# EAGLE design DQ542MA GRBL (EAGLE 8.4.3)
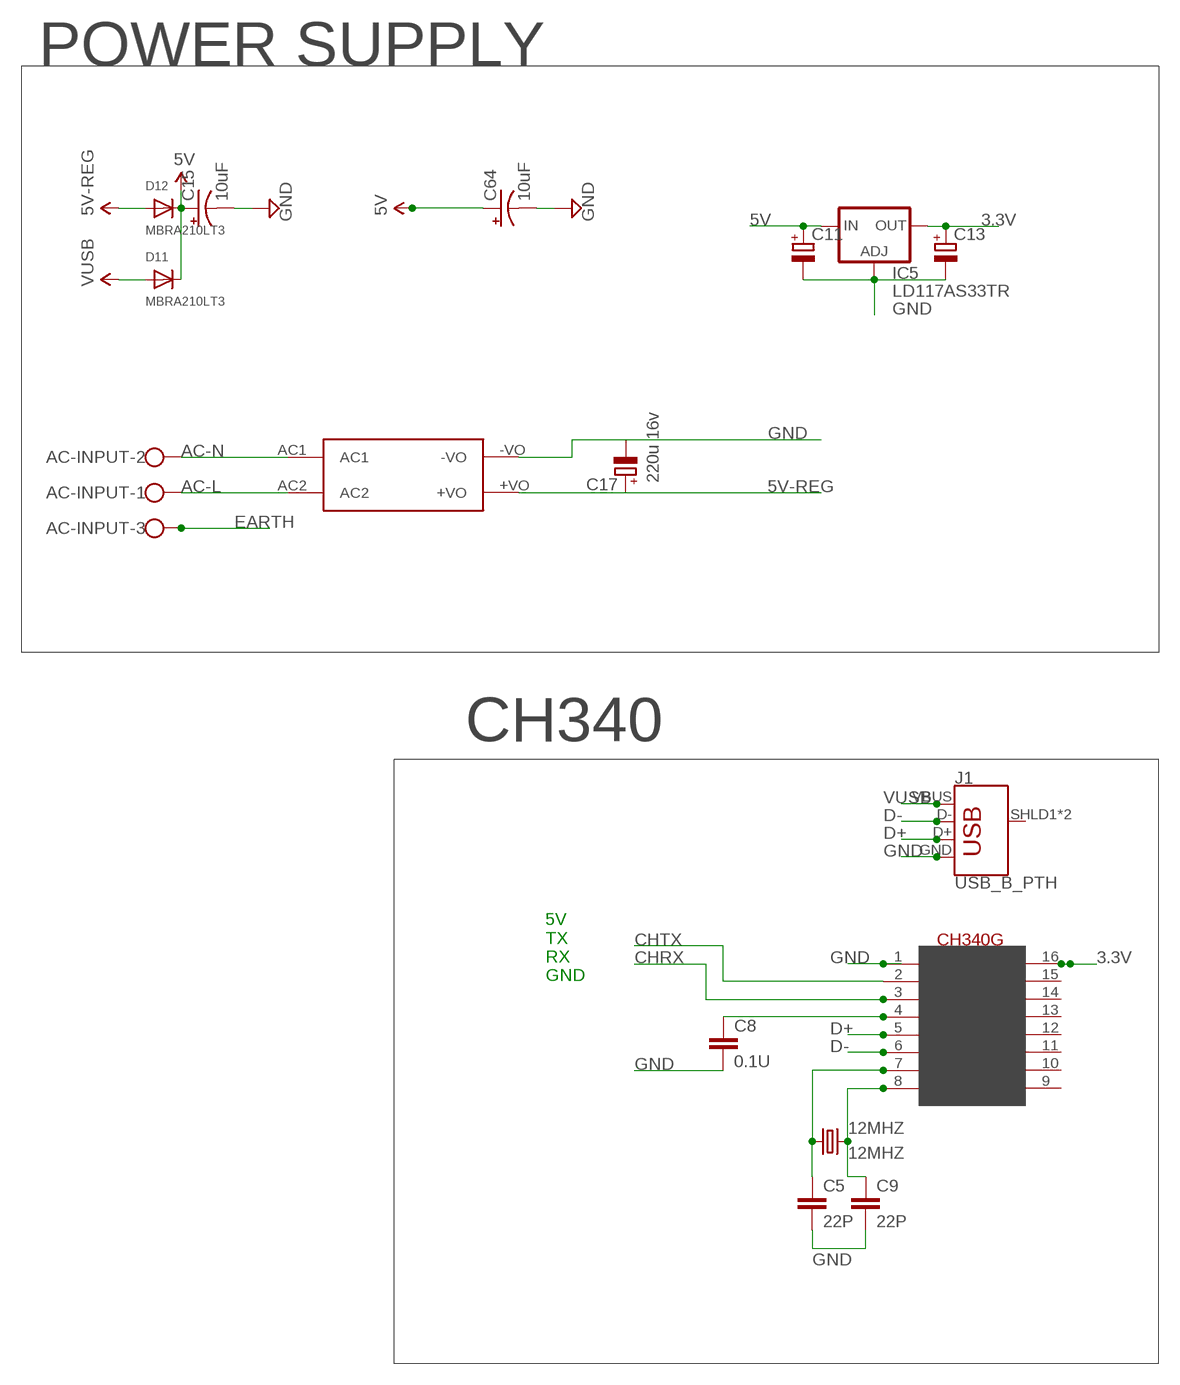
[diagram p0: schematic, sheet 1]

## Parts
12MHZ  12MHZ  CRYSTALHC49U70  [HC49U70]
AC-INPUT  W237-103  [W237-103]
C5  22P  C-EUC1206  [C1206]
C8  0.1U  C-EUC1206  [C1206]
C9  22P  C-EUC1206  [C1206]
C11  CPOL-EUC  [PANASONIC_C]
C13  CPOL-EUC  [PANASONIC_C]
C15  10uF  CAP_POL1206  [EIA3216]
C17  220u 16v  CPOL-EUE  [PANASONIC_E]
C64  10uF  CAP_POL1206  [EIA3216]
D11  MBRA210LT3  DIODESMA  [SMADIODE]
D12  MBRA210LT3  DIODESMA  [SMADIODE]
IC5  LD117AS33TR  [SOT223]
J1  USB_B_PTH  [USB-B-PTH]
U$2  CH340G  [SOIC16]
U$4  HLK-PM01  [HLK-PM01]

## Nets
3.3V: C8.1 C13.+ IC5.4(OUT) U$2.4(V3) U$2.16(VCC)
5V: C11.+ C15.A(+) C64.A(+) D11.C D12.C IC5.3(IN)
5V-REG: C17.+ D12.A U$4.+VO
AC-L: AC-INPUT.1 U$4.AC2
AC-N: AC-INPUT.2 U$4.AC1
CHRX: U$2.3(RX)
CHTX: U$2.2(TX)
D+: J1.D+ U$2.5(D+)
D-: J1.D- U$2.6(D-)
EARTH: AC-INPUT.3
GND: C5.2 C8.2 C9.2 C11.- C13.- C15.C(-) C17.- C64.C(-) IC5.1(ADJ) J1.GND U$2.1(GND) U$4.-VO
N$9: 12MHZ.1 C5.1 U$2.7(XI)
N$11: 12MHZ.2 C9.1 U$2.8(XO)
VUSB: D11.A J1.VBUS
Unconnected: J1.SHLD1(SHIELD) J1.SHLD2(SHIELD) U$2.9(CTS) U$2.10(DSR) U$2.11(RI) U$2.12(DCD) U$2.13(DTR) U$2.14(RTS) U$2.15(RS232)

## Notes on the sheet
- POWER SUPPLY
- CH340
- 5V
  TX
  RX
  GND

## Library data of the parts
12MHZ = crystal:CRYSTAL: CRYSTAL; OC_FARNELL: unknown; OC_NEWARK: unknown
AC-INPUT = con-wago-500:W237-103: WAGO SCREW CLAMP; MPN: 237-103; OC_FARNELL: unknown; OC_NEWARK: 18M7116
C5 C8 C9 = rcl:C-EU: CAPACITOR, European symbol
C11 C13 C17 = rcl:CPOL-EU: POLARIZED CAPACITOR, European symbol
C15 C64 = SparkFun:CAP_POL: Capacitor Polarized These are standard SMD and PTH capacitors. Normally 10uF, 47uF, and 100uF in electrolytic and tantalum varieties. Always verify the external diameter of the through hole cap, it varies with capacity, voltage, and manufacturer. The EIA devices should be standard.
D11 D12 = microbuilder:DIODE: Diode SMADIODE - SMA Surface Mount Package 20V 1A Schottky Diode Digikey (500mV @ 1A, 500uA Vr @ 20V): 641-1014-6-ND 10V 2A Schottky Diode Digikey (350mV @ 2A, 700uA Vr @ 10V): MBRA210LT3 SOD-123 30V 200mA (800mV Vf, 2uA Vr @ 25V) Schottky Diode (very fast switching for boost, etc.) - Digikey: BAT54T1GOSTR-ND 30V 500mA (430mV Vf, 130uA Vr @ 30V) Schottky Diode - Digikey: B0530W-FDICT-ND MBR120 1A 20V (0.34Vf) Schottky Diode - Digikey: MBR120VLSFT1GOSCT-ND SOD-323 10V 570mA (380mV Vf, 3ns) Schottky Diode - Digikey: ZLLS410CT-ND 1N4148WS - 75V 150mA (1V Vf @ 10mA, 4ns) Simple Diode - Digikey: 1N4148WSFSCT-ND, Mouser: 512-1N4148WS SOD-523 BAT54 30V 200mA Schottky (0.8 Vf @ 100mA, 5ns) - Digikey: BAT54XV2CT-ND 30V 30mA Schottky Diode (RB751S-40TE61) - Digikey: RB751S-40TE61CT-ND SOT23-R/W - SOT23 Package (R = Solder Paste/Reflow Ovens, W = Hand-Soldering) BAT54Film 40V 300mA - Digikey: 497-7162-1-ND DO-1N4148 Through Hole Small Current Diode (any model)
IC5 = v-reg:LD117A?*: Low drop fixed and adjustable positive voltage regulators 1 A Source: http://www.st.com/stonline/products/literature/ds/7194/ld1117axx.pdf
J1 = SparkFun-Connectors:USB_B: USB Type B Connector SparkFun Products: SparkFun Stepoko <https://www.sparkfun.com/products/13899> PTH; PROD_ID: CONN-08278; SF_ID: PRT-00139
U$2 = usb-serial:CH340G
U$4 = hlk-pm01:HLK-PM01

## Net classes
1 power: width 0.6 mm, clearance 0.305 mm
5 3.3-Amp Class: width 1.27 mm

## Board
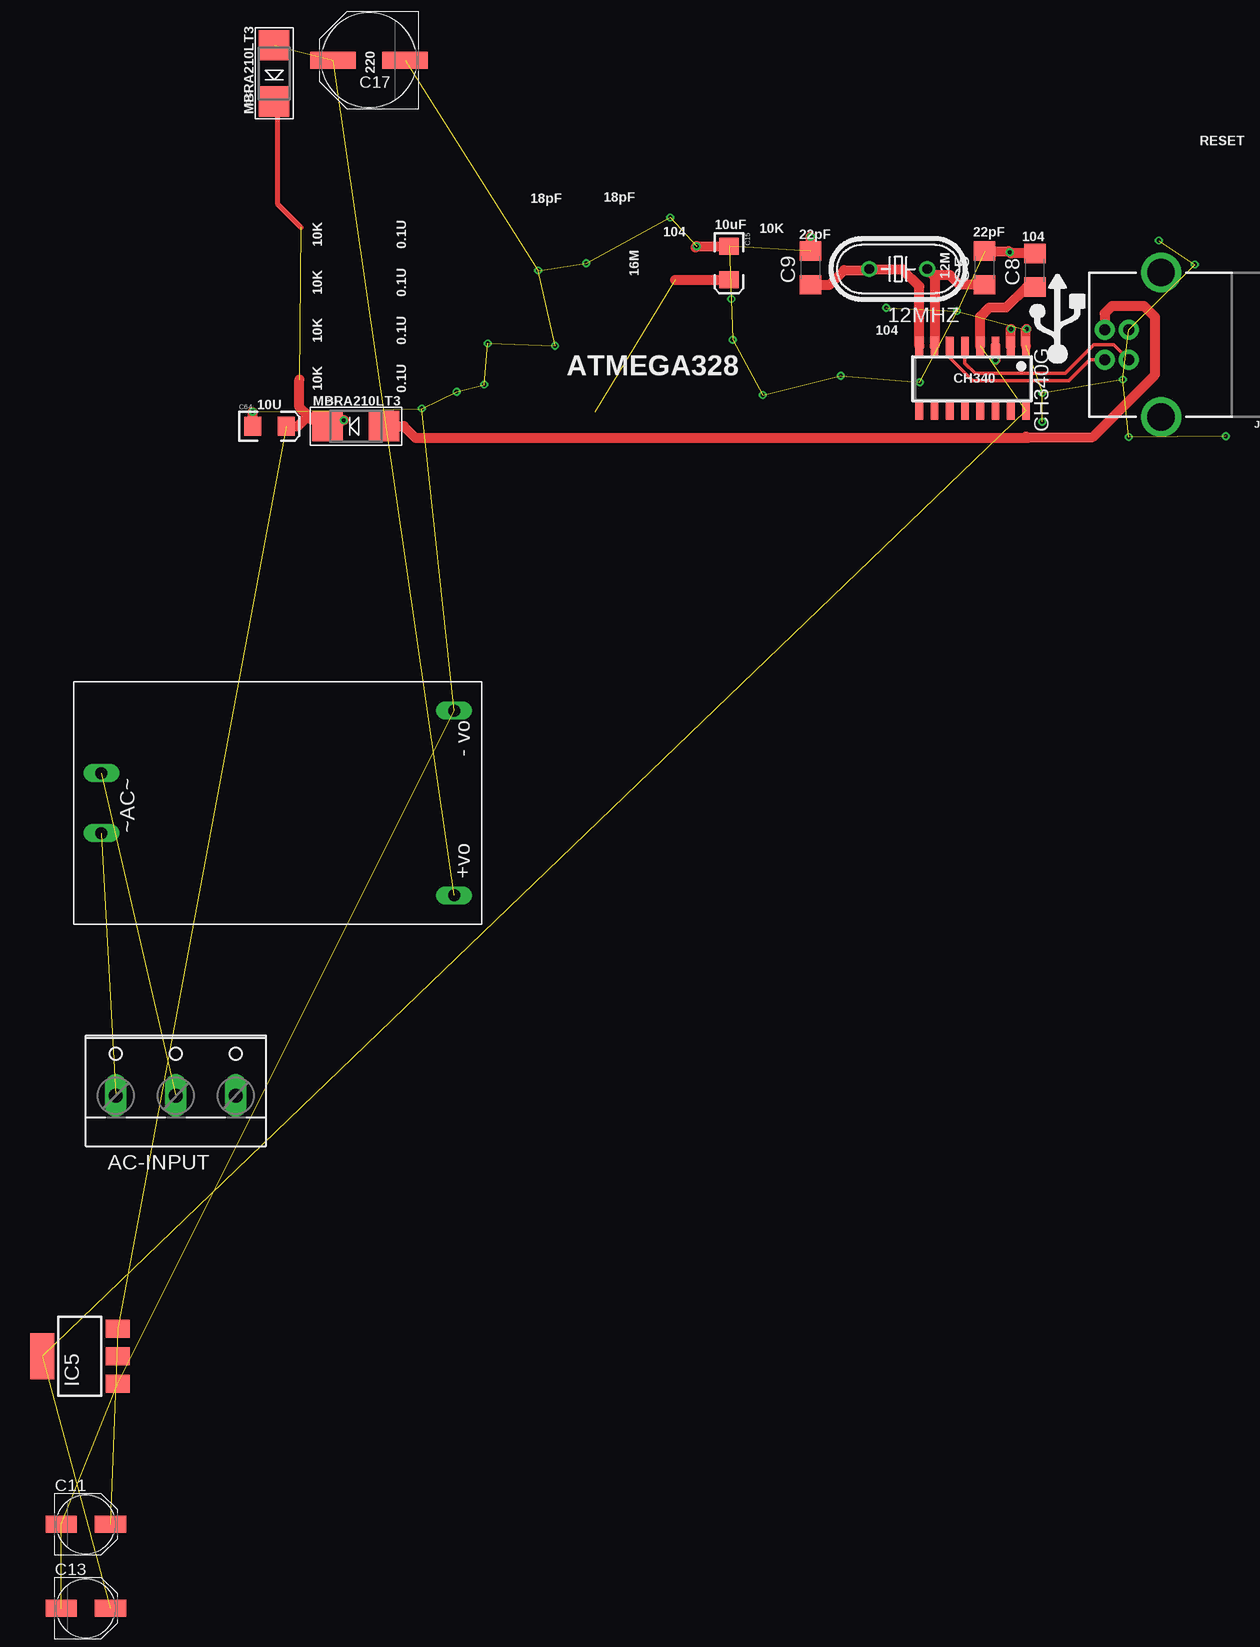
[diagram p1: board, top side]
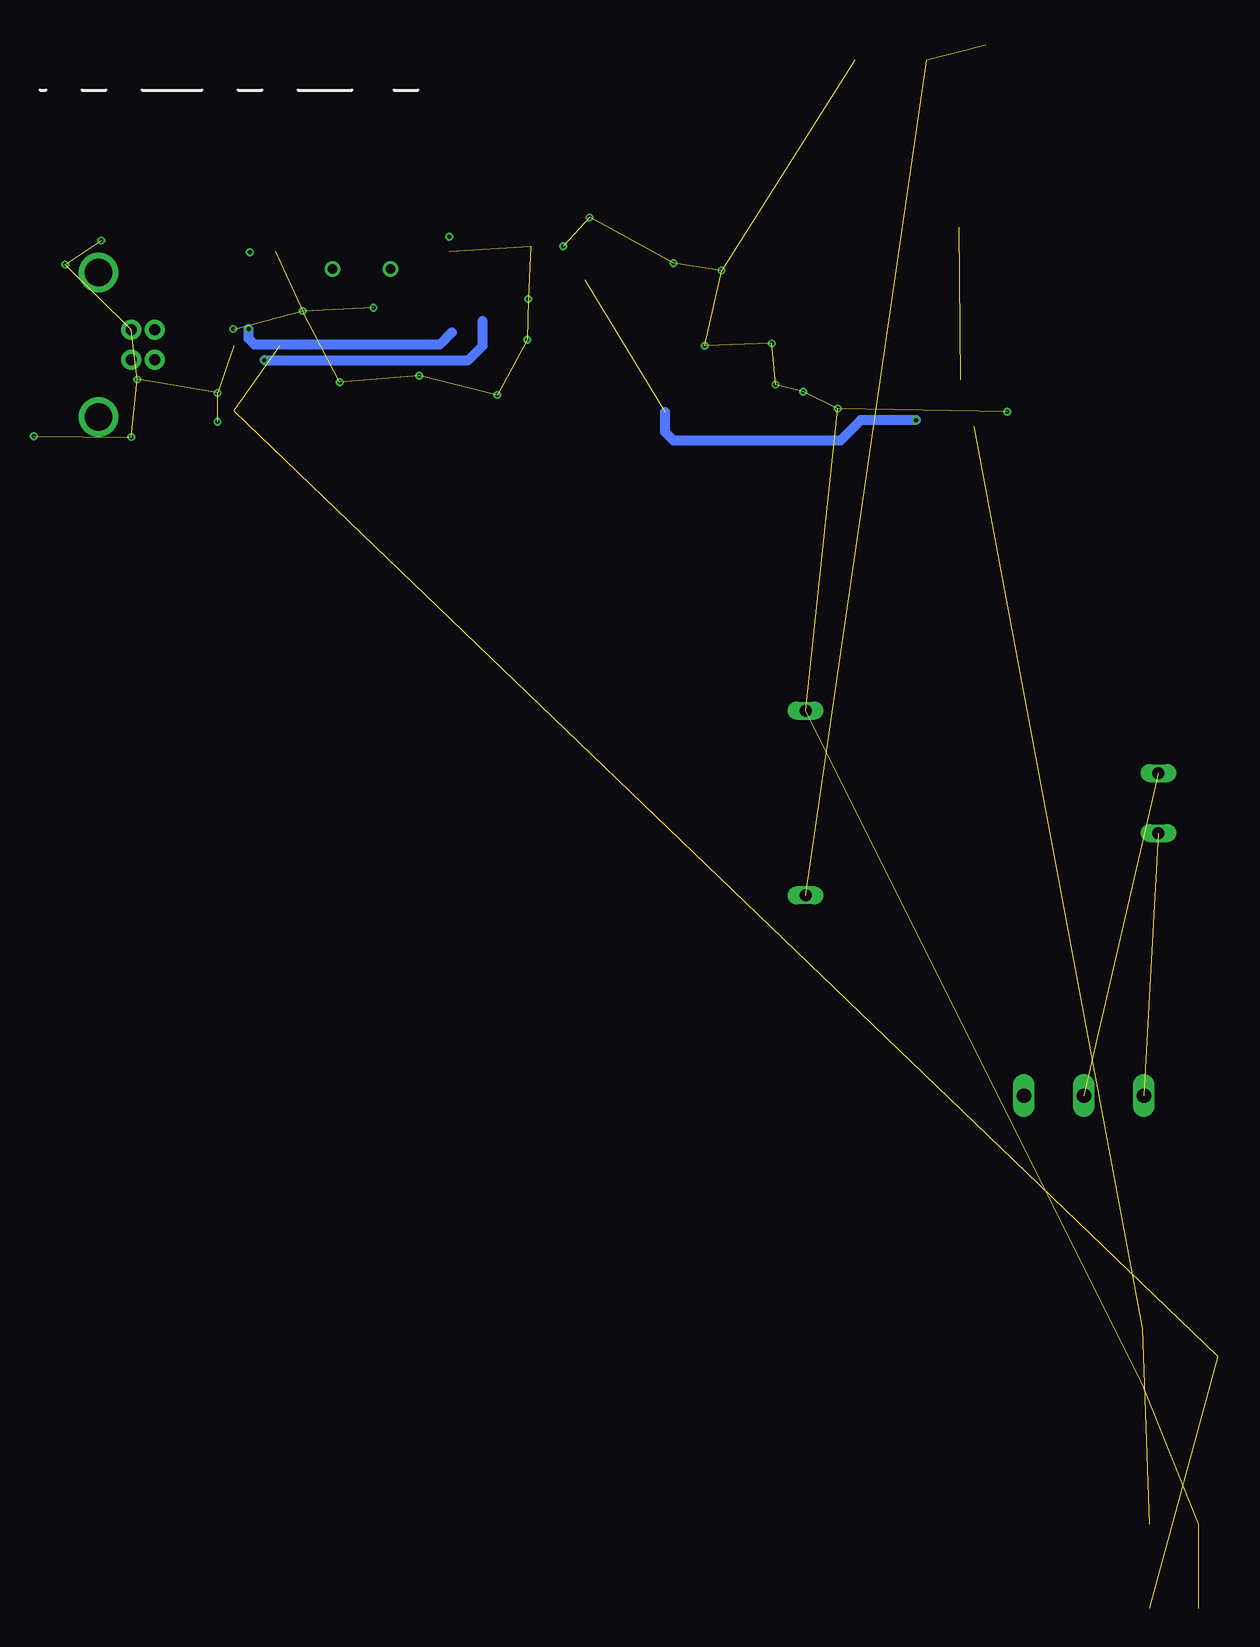
[diagram p2: board, bottom side, seen from below]

No outline drawn. Coordinates in mm, seen from the top.
Copper layers (1*16): Top 0.035mm / dielectric 1.5mm / Bottom 0.035mm
Design rules "dirt_cheap_dirty_boards.v1": minimum track width 5mil, minimum drill 12mil, track to track 5mil, track to pad 5mil, pad to pad 5mil, via to via 5mil, smd to smd 0mil, copper to edge 10mil, drill to drill 10mil, minimum pad ring 10mil, minimum via ring 6mil, stop-mask expansion 2mil, vias tented up to drill 25mil, thermal gap 10mil

### Footprints (pad centres in the part's own frame; a part is rotated, then mirrored left to right if it is on the bottom)
HC49U70 = drill 0.813: 1 -2.413,0; 2 2.413,0
W237-103 = drill 1.194 long: 1 -5,-1.29; 2 0,-1.29; 3 5,-1.29
C1206 = smd 1.6 x 1.8: 1 -1.4,0; 2 1.4,0
PANASONIC_C = smd 2.6 x 1.4: + 2.05,0; - -2.05,0
EIA3216 = smd 1.4 x 1.6: A 1.4,0; C -1.4,0
PANASONIC_E = smd 3.8 x 1.4: + 3,0; - -3,0
SMADIODE = smd 2.54 x 2.54: A 2.349,0; C -2.349,0
SOT223 = smd 1.5 x 2: 1 -2.3,-3.15; 2 0,-3.15; 3 2.3,-3.15 | smd 3.8 x 2: 4 0,3.15
USB-B-PTH = drill 0.914 pad 1.676: D+ 4,1.25; D- 5.981,1.25; GND 4,-1.25; VBUS 5.981,-1.25 | drill 2.286: SHLD1 1.282,-6.02; SHLD2 1.282,6.02
SOIC16 = smd 0.635 x 1.524: 1 -4.445,-2.695; 2 -3.175,-2.695; 3 -1.905,-2.695; 4 -0.635,-2.695; 5 0.635,-2.695; 6 1.905,-2.695; 7 3.175,-2.695; 8 4.445,-2.695; 9 4.445,2.695; 10 3.175,2.695; 11 1.905,2.695; 12 0.635,2.695; 13 -0.635,2.695; 14 -1.905,2.695; 15 -3.175,2.695; 16 -4.445,2.695
HLK-PM01 = drill 1 long: +VO 31.7,2.4; -VO 31.7,17.8; AC1 2.3,12.6; AC2 2.3,7.6

### Placement (x,y rotation side)
12MHZ  77.2,9.1 180 top
AC-INPUT  17,-58.5 0 top
C5  84.4,9.2 90 top
C8  88.6,9 90 top
C9  69.9,9.2 90 top
C11  9.5,-95.5 0 top
C13  9.5,-102.5 0 top
C15  63.1,9.6 270 top
C17  33.1,26.5 180 top
C64  24.8,-4 0 top
D11  32,-4 0 top
D12  25.2,25.4 90 top
IC5  9,-81.5 90 top
J1  100.4,2.8 180 top
U$2  83.4,0 180 top
U$4  8.5,-45.5 0 top

### Tracks (layer width: path | path; a pad name or v marks a point on that pad's centre or on a via)
3.3V  (3 unrouted)
  Top 0.813: U$2.4 84.03,5.13 84.8,5.9 86.2,5.9 87.9,7.6 C8.1
5V  (via drill 0.35)  (4 unrouted)
  Top 0.254: C15.A 63.68,8.2
  Top 0.406: D12.C 25.2,22.8 25.5,22.5 25.5,14.5 27.42,12.58
  Top 0.813: v31,-3.5 D11.C 29.37,-3.42 28.32,-3.42 28.03,-3.13 | 58.6,8.2 C15.A | 28.03,-3.13 27.3,-2.4 27.3,-0.12 | C64.A 27.17,-4 28.03,-3.13
  Bottom 0.813: v31,-3.5 35.6,-3.5 37.3,-5.2 51.2,-5.2 51.9,-4.5 51.9,-2.82
5V-REG  (2 unrouted)
AC-L  (1 unrouted)
AC-N  (1 unrouted)
CHRX  (via drill 0.35)
  Top 0.813: U$2.3 v85.31,1.5 v85.3,1.5
  Bottom 0.813: v85.3,1.5 68.3,1.5 67.1,2.7 67.1,4.78
CHTX  (via drill 0.35)
  Top 0.813: U$2.2 86.58,4.08 v86.6,4.1
  Bottom 0.813: 69.67,3.83 70.7,2.8 86.1,2.8 86.6,3.3 v86.6,4.1
D+
  Top 0.305: U$2.5 82.77,1.24 83.6,0.4 91.1,0.4 93.5,2.8 95.15,2.8 J1.D+
D-
  Top 0.305: J1.D- 93.15,1.55 91.4,-0.2 83.4,-0.2 81.5,1.71 U$2.6
GND  (via drill 0.35)  (32 unrouted)
  Top 0.813: U$2.1 87.84,4.04 v87.9,4.1 | C5.2 86.4,10.6 v86.5,10.5 86.6,10.4 C8.2 | C9.2 v69.9,11.8 | 60.3,10.9 v60.4,11 C15.C | C64.C v23.4,-2.8
  other vias: 48.6,2.7 72.4,0.2 95.9,-0.1 58.2,13.4 82.1,5.6 96.4,-4.9 63.4,3.2 63.3,6.6 65.9,-1.4 43,2.9 51.2,9.57 47.2,8.97 76.2,5.87 89.2,-1.23 89.2,-3.63 79,-0.33 98.9,11.47 101.9,9.47 42.7,-0.53 40.4,-1.13 37.5,-2.53 104.5,-4.83
N$9
  Top 0.813: 80.22,8.49 U$2.7 | 80.22,8.49 12MHZ.1 | C5.1 82.3,7.8 81.5,8.6 80.34,8.6 80.22,8.49
N$11
  Top 0.813: U$2.8 78.95,7.64 77.5,9.1 12MHZ.2 74.69,9 72.7,9 71.5,7.8 C9.1
VUSB
  Top 0.813: D11.A 36,-4 37,-5 88,-5 87.81,-4.9 | 87.81,-4.9 93.4,-4.9 98.6,0.3 98.6,5.1 97.7,6 95,6 94.4,5.4 94.4,4.07 J1.VBUS | 87.84,-4.87 87.81,-4.9

### Text on the board
tPlace: 220 | MBRA210LT3 | RESET | 18pF | 18pF | 10K | 22pF | 10K | 0.1U | 104 | 10uF | 22pF | 104 | 10K | 0.1U | 16M | 12M | 10K | 0.1U | 104 | ATMEGA328 | 10K | 0.1U | CH340 | 10U | MBRA210LT3
tStop: (2017) | By Peter van der Walt | POWER | MOTORS OFF | M3/M5 | M8/M9 | DQ542MA | BASEBOARD